# EAGLE design vapeduino_shield_v0001 (EAGLE 8.0.0)

## Sheet 1 of 7
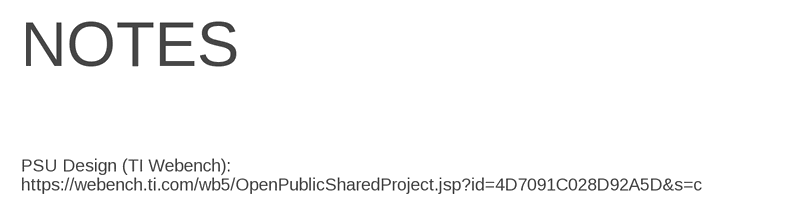
[diagram p0: schematic, sheet 1]

### Notes on the sheet
- NOTES
- PSU Design (TI Webench):
  https://webench.ti.com/wb5/OpenPublicSharedProject.jsp?id=4D7091C028D92A5D&s=c

## Sheet 2 of 7
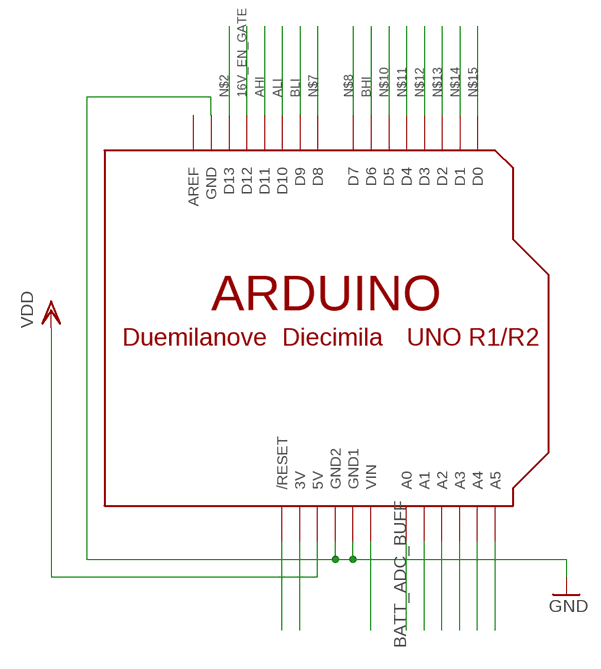
[diagram p1: schematic, sheet 2]

### Parts
U$1  ARDUINOUNO  [ARDUINO]

### Nets
16V_EN_GATE: U$1.D12 ; also sheet 4
AHI: U$1.D11 ; also sheet 5
ALI: U$1.D10 ; also sheet 5
BATT_ADC_BUFF: U$1.A0 ; also sheet 6
BHI: U$1.D6 ; also sheet 5
BLI: U$1.D9 ; also sheet 5
COIL_RES_ADC: U$1.A1 ; also sheet 7
GND: U$1.GND U$1.GND1 U$1.GND2 ; also sheet 3,4,5,6,7
N$2: U$1.D13
N$7: U$1.D8
N$8: U$1.D7
N$10: U$1.D5
N$11: U$1.D4
N$12: U$1.D3
N$13: U$1.D2
N$14: U$1.D1
N$15: U$1.D0
N$16: U$1.RESET(/RESET)
N$17: U$1.3V
N$21: U$1.VIN
N$24: U$1.A2
N$25: U$1.A3
N$26: U$1.A4
N$27: U$1.A5
VDD: U$1.5V ; also sheet 3,4,7
Unconnected: U$1.AREF

## Sheet 3 of 7: 5V
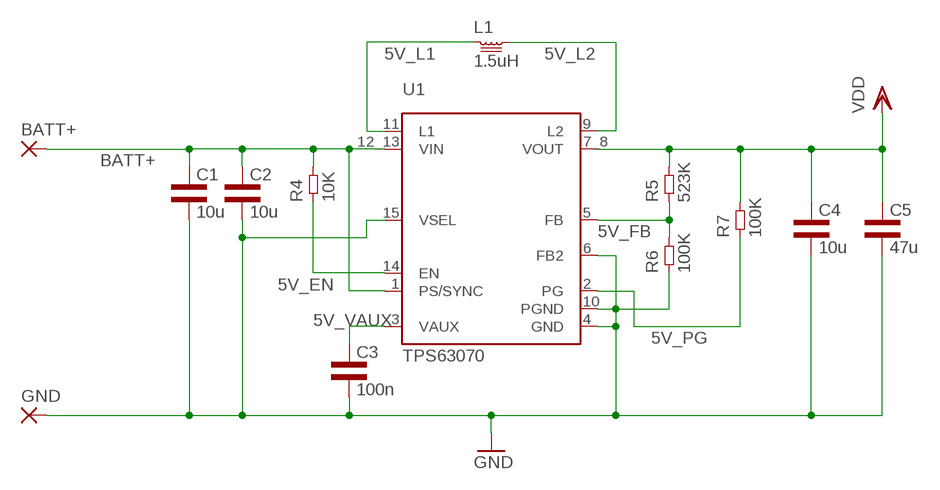
[diagram p2: schematic, sheet 3]

### Parts
BATT+  SMD5  [SMD2,54-5,08]
C1  10u  CAP0603L3  [0603L3]
C2  10u  CAP0603L3  [0603L3]
C3  100n  CAP0603L3  [0603L3]
C4  10u  CAP0603L3  [0603L3]
C5  47u  CAP0805L3  [0805L3]
GND  SMD5  [SMD2,54-5,08]
L1  1.5uH  INDUCTOR4X4  [4X4]
R4  10K  RES0603L3  [0603L3]
R5  523K  RES0603L3  [0603L3]
R6  100K  RES0603L3  [0603L3]
R7  100K  RES0603L3  [0603L3]
U1  TPS63070  [VQFN-HR]

### Nets
5V_EN: R4.P$1 U1.14(EN)
5V_FB: R5.P$1 R6.P$2 U1.5(FB)
5V_L1: L1.1 U1.11(L1)
5V_L2: L1.2 U1.9(L2)
5V_PG: R7.P$1 U1.2(PG)
5V_VAUX: C3.P$1 U1.3(VAUX)
BATT+: BATT+.1(P) C1.P$1 C2.P$1 R4.P$2 U1.1(PS/SYNC) U1.12_13(VIN) ; also sheet 4,6
GND: C1.P$2 C2.P$2 C3.P$2 C4.P$2 C5.2 GND.1(P) R6.P$1 U1.4(GND) U1.6(FB2) U1.10(PGND) U1.15(VSEL) ; also sheet 2,4,5,6,7
VDD: C4.P$1 C5.1 R5.P$2 R7.P$2 U1.7_8(VOUT) ; also sheet 2,4,7

## Sheet 4 of 7: 16V
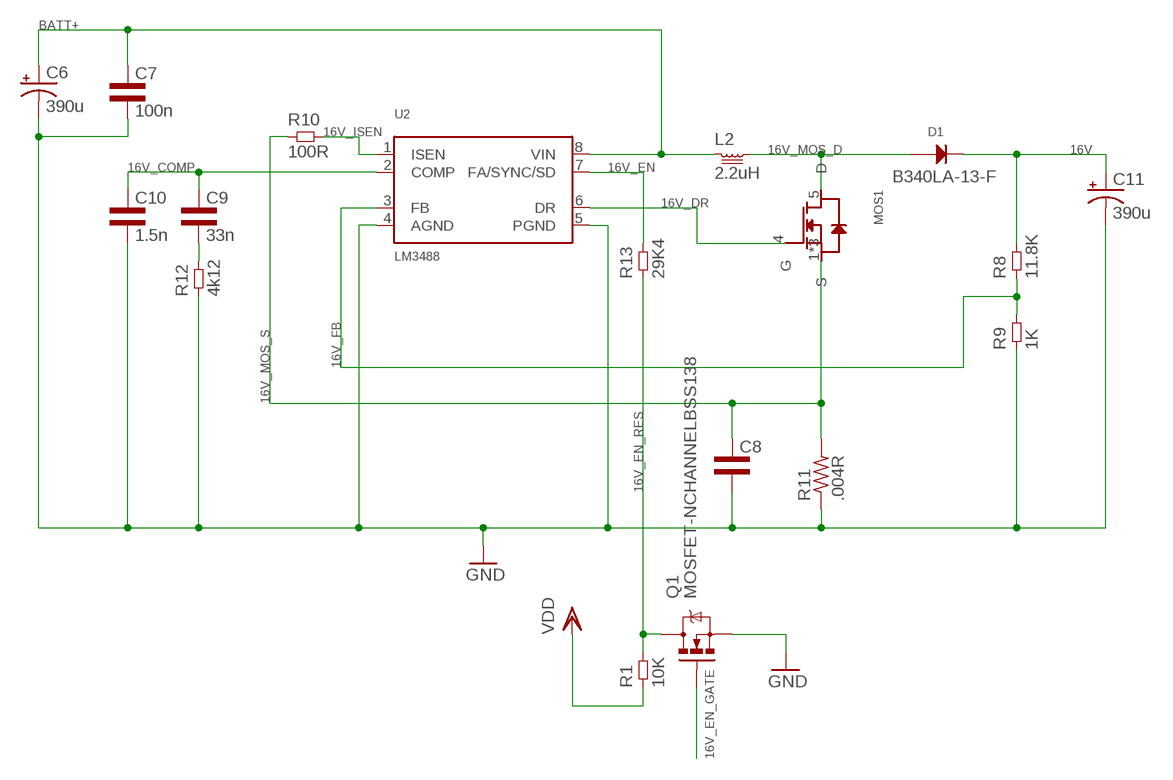
[diagram p3: schematic, sheet 4]

### Parts
C6  390u  CPOL-USG  [PANASONIC_G]
C7  100n  CAP0603L3  [0603L3]
C8  CAP0603L3  [0603L3]
C9  33n  CAP0402L3  [0402L3]
C10  1.5n  CAP0402L3  [0402L3]
C11  390u  CPOL-USG  [PANASONIC_G]
D1  DIODESMA  [SMA]
L2  2.2uH  INDUCTOR7.7X8  [7.7X8]
MOS1  MOSFET-NQ3  [Q3]
Q1  MOSFET-NCHANNELBSS138  [SOT23]
R1  10K  RES0603L3  [0603L3]
R8  11.8K  RES0603L3  [0603L3]
R9  1K  RES0603L3  [0603L3]
R10  100R  RES0603L3  [0603L3]
R11  .004R  R-US_R2512  [R2512]
R12  4k12  RES0402L3  [0402L3]
R13  29K4  RES0603L3  [0603L3]
U2  LM3488  [S-PDSO-G8]

### Nets
16V: C11.+ D1.2(CATHODE) R8.P$2 ; also sheet 5,6
16V_COMP: C9.P$1 C10.P$1 U2.2(COMP)
16V_DR: MOS1.4(G) U2.6(DR)
16V_EN: R13.P$2 U2.7(FA/SYNC/SD)
16V_EN_GATE: Q1.1(G) ; also sheet 2
16V_EN_RES: Q1.3(D) R1.P$2 R13.P$1
16V_FB: R8.P$1 R9.P$2 U2.3(FB)
16V_ISEN: R10.P$2 U2.1(ISEN)
16V_MOS_D: D1.1(ANODE) L2.2 MOS1.5(D)
16V_MOS_S: C8.P$1 MOS1.1(S) MOS1.2(S) MOS1.3(S) R10.P$1 R11.2
BATT+: C6.+ C7.P$1 L2.1 U2.8(VIN) ; also sheet 3,6
GND: C6.- C7.P$2 C8.P$2 C10.P$2 C11.- Q1.2(S) R9.P$1 R11.1 R12.P$1 U2.4(AGND) U2.5(PGND) ; also sheet 2,3,5,6,7
N$33: C9.P$2 R12.P$2
VDD: R1.P$1 ; also sheet 2,3,7

## Sheet 5 of 7
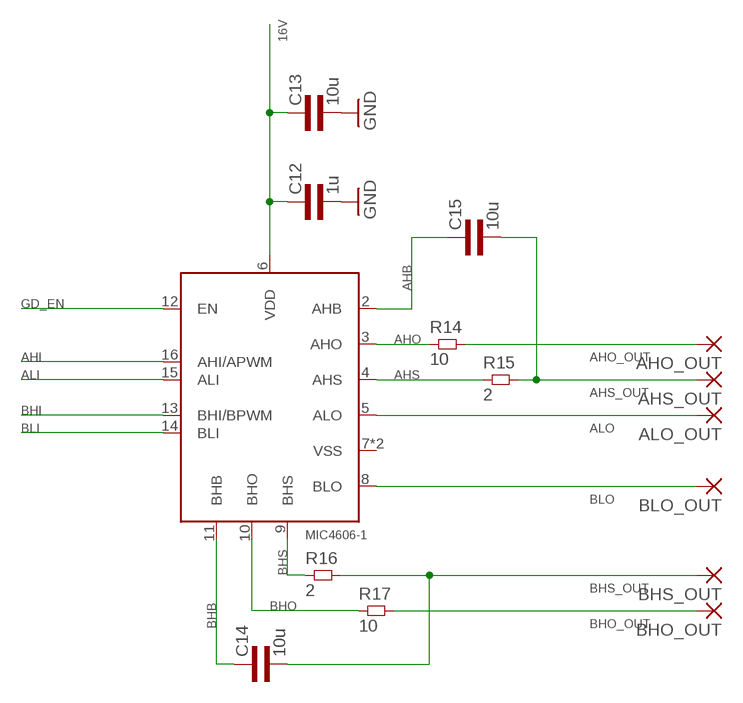
[diagram p4: schematic, sheet 5]

### Parts
AHO_OUT  3,17/1,3  [3,17/1,3]
AHS_OUT  3,17/1,3  [3,17/1,3]
ALO_OUT  3,17/1,3  [3,17/1,3]
BHO_OUT  3,17/1,3  [3,17/1,3]
BHS_OUT  3,17/1,3  [3,17/1,3]
BLO_OUT  3,17/1,3  [3,17/1,3]
C12  1u  CAP0603L3  [0603L3]
C13  10u  CAP0805L3  [0805L3]
C14  10u  CAP1206L3  [1206L3]
C15  10u  CAP1206L3  [1206L3]
MD1  MIC4606-1  [QFN44-16LD-PL-2]
R14  10  RES0805L3  [0805L3]
R15  2  RES0805L3  [0805L3]
R16  2  RES0805L3  [0805L3]
R17  10  RES0805L3  [0805L3]

### Nets
16V: C12.P$1 C13.1 MD1.6(VDD) ; also sheet 4,6
AHB: C15.1 MD1.2(AHB)
AHI: MD1.16(AHI/APWM) ; also sheet 2
AHO: MD1.3(AHO) R14.1
AHO_OUT: AHO_OUT.1(P) R14.2
AHS: MD1.4(AHS) R15.1
AHS_OUT: AHS_OUT.1(P) C15.2 R15.2 ; also sheet 7
ALI: MD1.15(ALI) ; also sheet 2
ALO: ALO_OUT.1(P) MD1.5(ALO)
BHB: C14.1 MD1.11(BHB)
BHI: MD1.13(BHI/BPWM) ; also sheet 2
BHO: MD1.10(BHO) R17.1
BHO_OUT: BHO_OUT.1(P) R17.2
BHS: MD1.9(BHS) R16.1
BHS_OUT: BHS_OUT.1(P) C14.2 R16.2
BLI: MD1.14(BLI) ; also sheet 2
BLO: BLO_OUT.1(P) MD1.8(BLO)
GD_EN: MD1.12(EN)
GND: C12.P$2 C13.2 ; also sheet 2,3,4,6,7
Unconnected: MD1.7(VSS) MD1.TP(VSS)

## Sheet 6 of 7
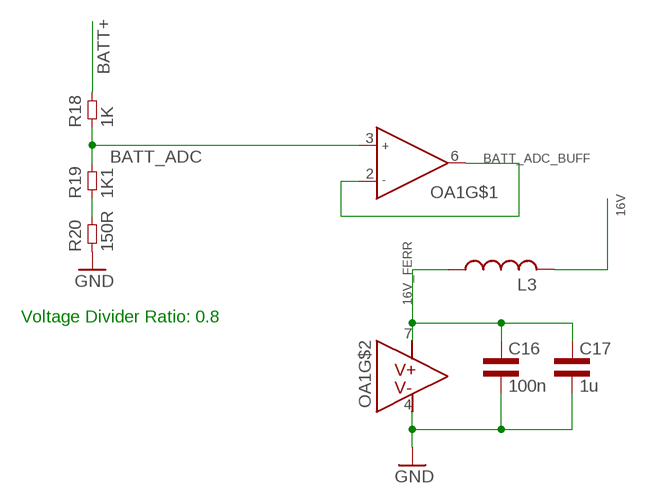
[diagram p5: schematic, sheet 6]

### Parts
C16  100n  CAP0603L3  [0603L3]
C17  1u  CAP0805L3  [0805L3]
L3  L-USL1812  [L1812]
OA1  OPA659DRB  [S-PVSON-N8]
R18  1K  RES0603L3  [0603L3]
R19  1K1  RES0603L3  [0603L3]
R20  150R  RES0603L3  [0603L3]

### Nets
16V: L3.2 ; also sheet 4,5
16V_FERR: C16.P$1 C17.1 L3.1 OA1.7(V+)
BATT+: R18.P$2 ; also sheet 3,4
BATT_ADC: OA1.3(INA+) R18.P$1 R19.P$2
BATT_ADC_BUFF: OA1.2(INA-) OA1.6(OUTA) ; also sheet 2
GND: C16.P$2 C17.2 OA1.4(V-) R20.P$1 ; also sheet 2,3,4,5,7
N$1: R19.P$1 R20.P$2

### Notes on the sheet
- Voltage Divider Ratio: 0.8

## Sheet 7 of 7
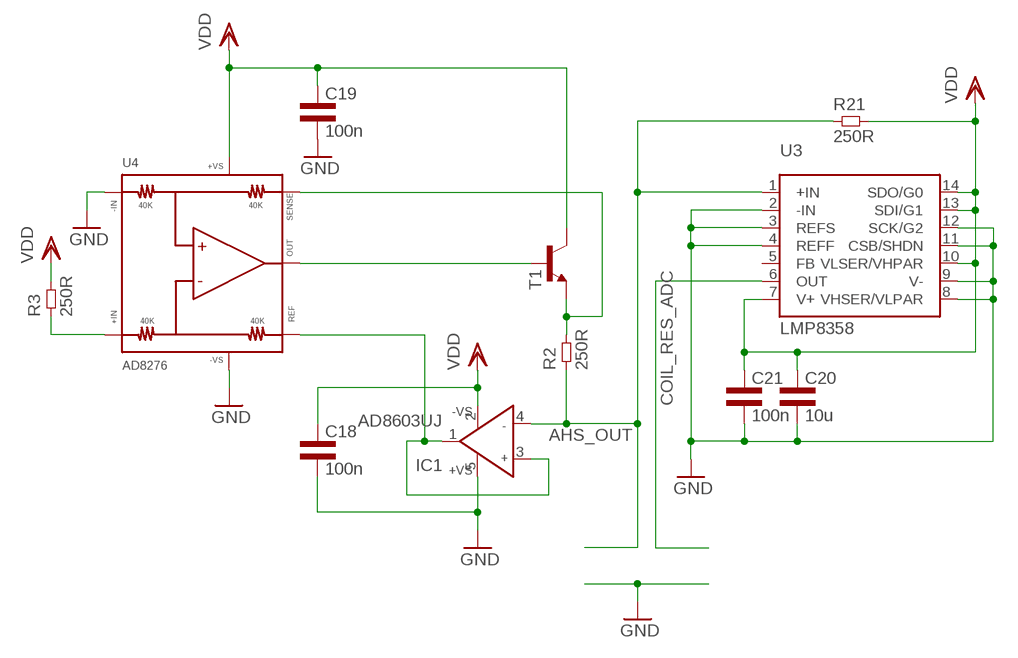
[diagram p6: schematic, sheet 7]

### Parts
C18  100n  CAP0603L3  [0603L3]
C19  100n  CAP0603L3  [0603L3]
C20  10u  CAP0805L3  [0805L3]
C21  100n  CAP0603L3  [0603L3]
IC1  AD8603UJ  [SOT23-5]
R2  250R  RES0603L3  [0603L3]
R3  250R  RES0603L3  [0603L3]
R21  250R  RES0603L3  [0603L3]
T1  TRANSISTOR_MMBT3904LT1-NPN-SOT23-BEC  [TRANSISTOR_SOT23-BEC]
U3  LMP8358  [R-PDSO-G14]
U4  AD8276BRMZ  [S-PDSO-G8]

### Nets
AHS_OUT: IC1.4(IN-) R2.P$1 R21.P$1 U3.1(+IN) ; also sheet 5
COIL_RES_ADC: U3.6(OUT) ; also sheet 2
GND: C18.P$2 C19.P$2 C20.2 C21.P$2 IC1.5(+VS) U3.2(-IN) U3.3(REFS) U3.4(REFF) U3.8(VHSER/VLPAR) U3.9(V-) U3.11(CSB/SHDN) U3.12(SCK/G2) U4.2(-IN) U4.4(-VS) ; also sheet 2,3,4,5,6
N$3: T1.B U4.6(OUT)
N$4: R2.P$2 T1.E U4.5(SENSE)
N$6: IC1.1(OUT) IC1.3(IN+) U4.1(REF)
N$18: R3.P$1 U4.3(+IN)
VDD: C18.P$1 C19.P$1 C20.1 C21.P$1 IC1.2(-VS) R3.P$2 R21.P$2 T1.C U3.7(V+) U3.10(VLSER/VHPAR) U3.13(SDI/G1) U3.14(SDO/G0) U4.7(+VS) ; also sheet 2,3,4
Unconnected: U3.5(FB)

## Library data of the parts
AHO_OUT AHS_OUT ALO_OUT BHO_OUT BHS_OUT BLO_OUT = wirepad:3,17/1,3: THROUGH-HOLE PAD
BATT+ GND = wirepad:SMD5: SMD PAD
C1-C5 C7-C10 C12-C21 = common:CAP
C6 C11 = rcl:CPOL-US: POLARIZED CAPACITOR, American symbol
D1 = common:DIODE; PART#: B340LA-13-F
IC1 = analog-devices:AD8603: Precision Micropower, Low Noise CMOS, Rail-to-Rail Input/Output Operational Amplifiers Source: http://www.analog.com/static/imported-files/data_sheets/AD8603_8607_8609.pdf; MF: ALTERA CORPORATION; MPN: AD8603AUJZ-REEL7; OC_FARNELL: 1651290; OC_NEWARK: 59K6904
L1 L2 = common:INDUCTOR
L3 = rcl:L-US: INDUCTOR, American symbol
MD1 = common:MIC4606: 85V Full-Bridge Mosfet Driver
MOS1 = common:MOSFET-N
OA1 = common:OPA659
Q1 = SparkFun-DiscreteSemi:MOSFET-NCHANNEL: Common NMOSFET Parts MFG P/N Store ID Prod ID FDD8780 TRANS-09984 SI7820DN TRANS-11055 FDS6630A IC-08089 2N7002PW TRANS-11151 FQP30N06L COM-10213 TRANS-10060 BSS123LT1G TRANS-08345 BSS138 TRANS-00830 BS170 2N7000; PROD_ID: TRANS-00830
R1-R10 R12-R21 = common:RES
R11 = rcl:R-US_: RESISTOR, American symbol
T1 = logic:TRANSISTOR_*-NPN-: NPN Transistror BF959 corrected 2008.03.06
U1 = common:TPS63070: TPS63070 High-efficiency, low quiescent current buck-boost converter. Input Range: 2.0V to 16V Output Range: 2.5V to 9V Output Current: 2.0A Buck/Boost
U2 = common:LM3488
U3 = common:LMP8358
U4 = common:AD8276
U$1 = adafruit:ARDUINO: Arduino Diecimila/Duemilanove Make a shield with ease, this package has all the named pins as well as the two mounting drill holes and an outline of the USB and DC power connector. The outline is on the DIMENSION layer, so if your board house uses it they will cut the outline to match. http://www.ladyada.net/library/pcb/eaglelibrary.html

## Board
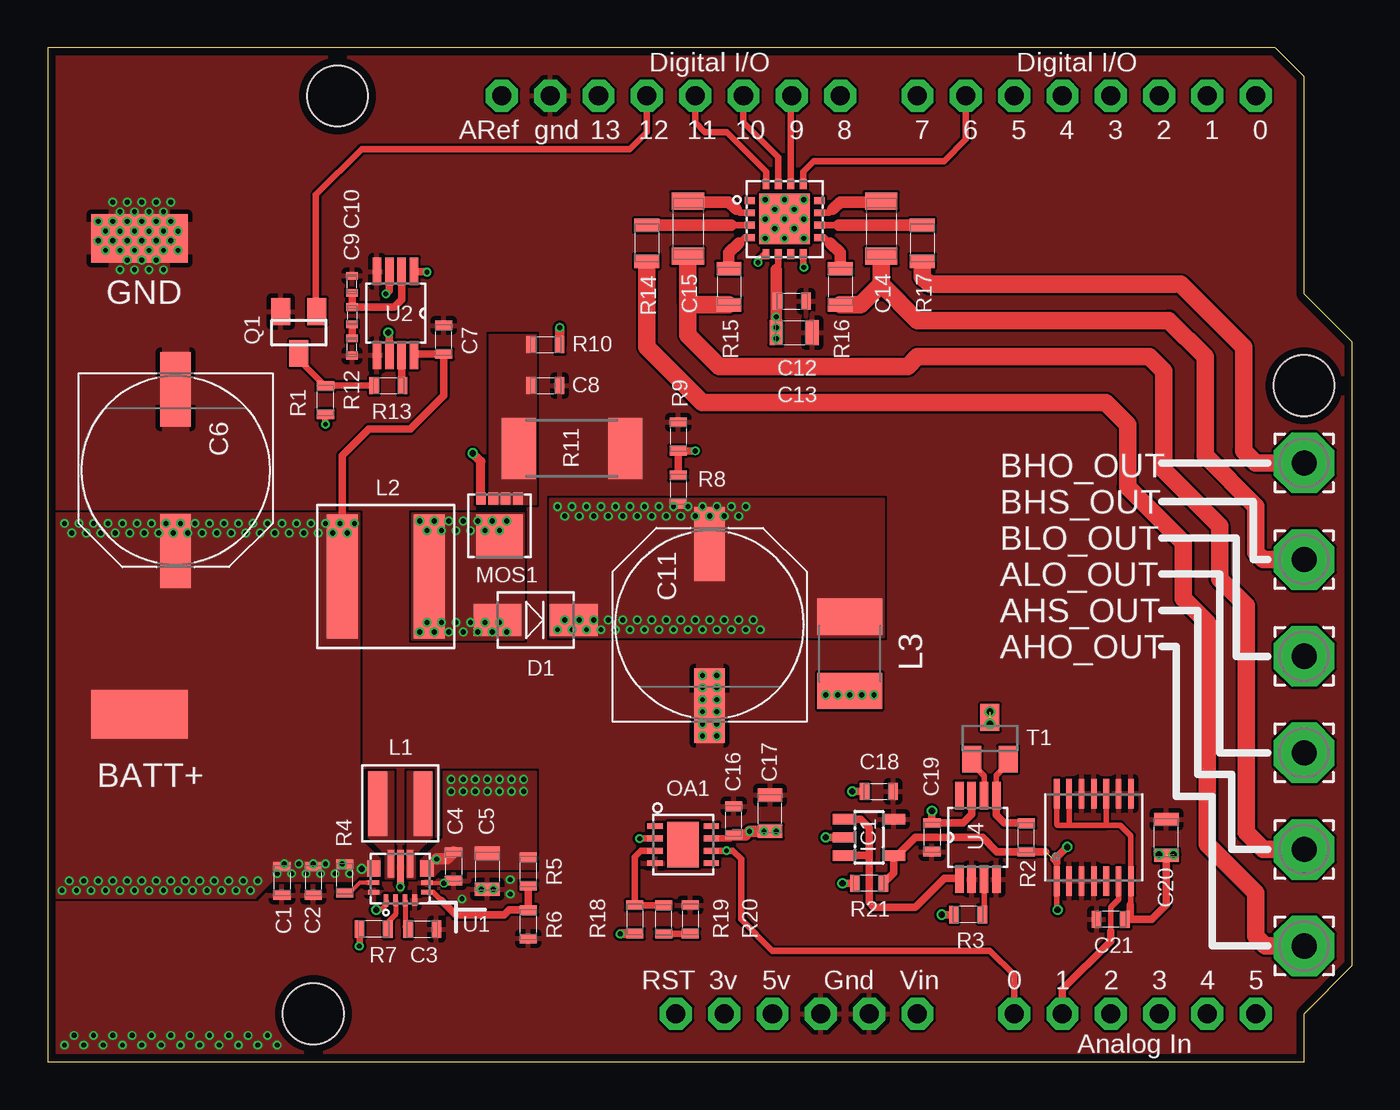
[diagram p7: board, top side]
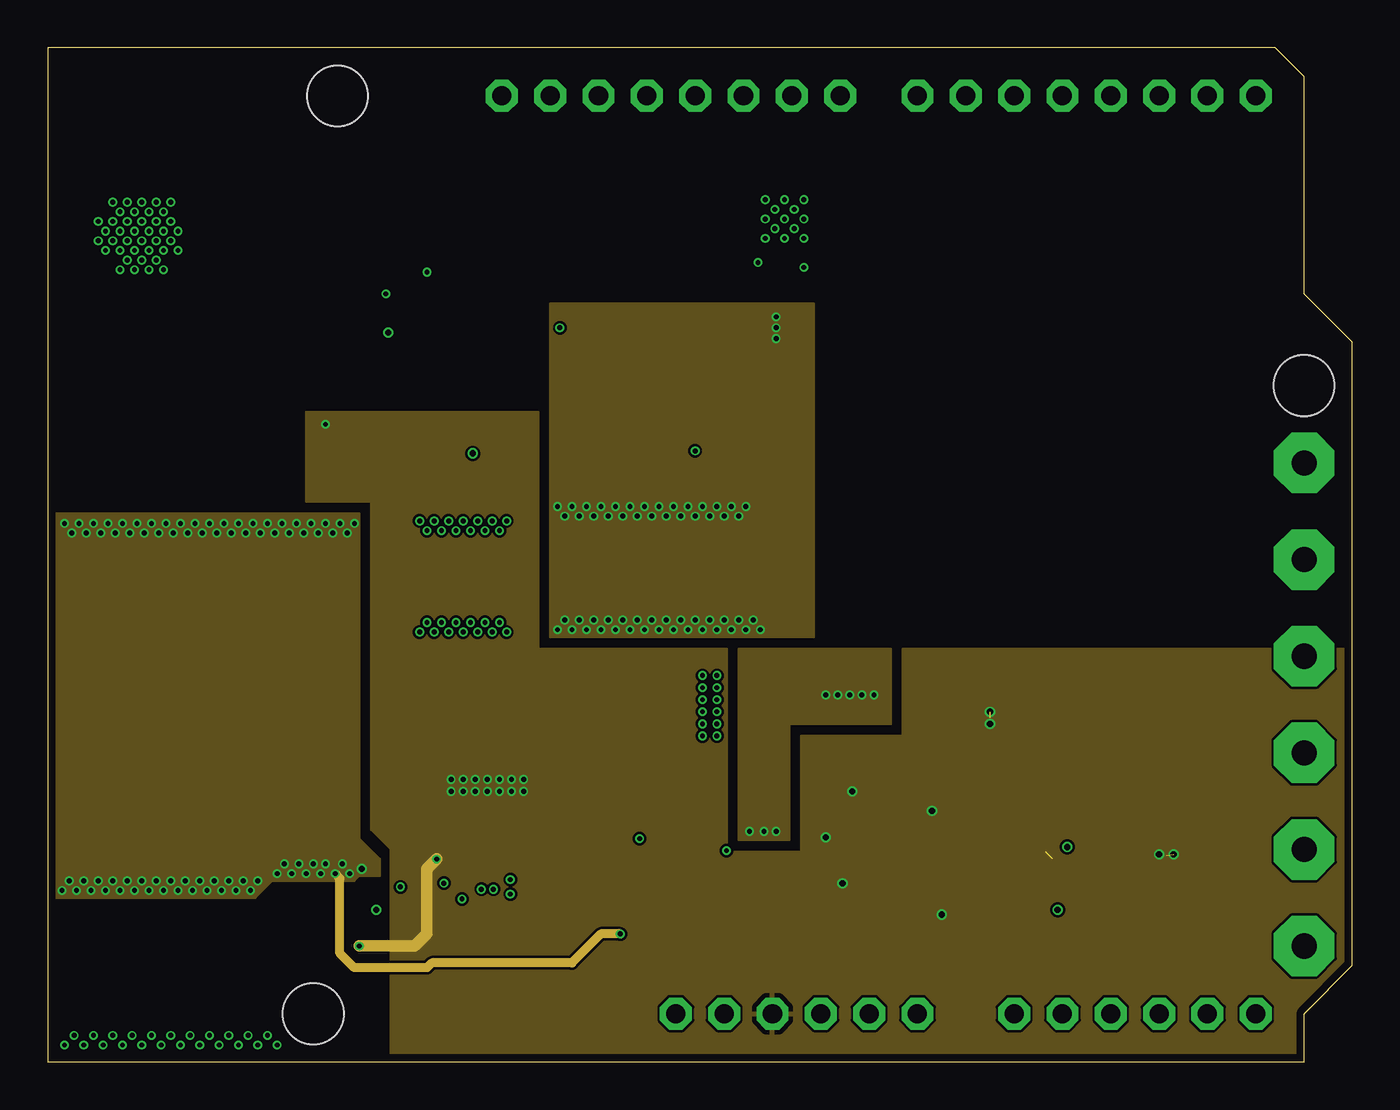
[diagram p8: board, inner layer Route2]
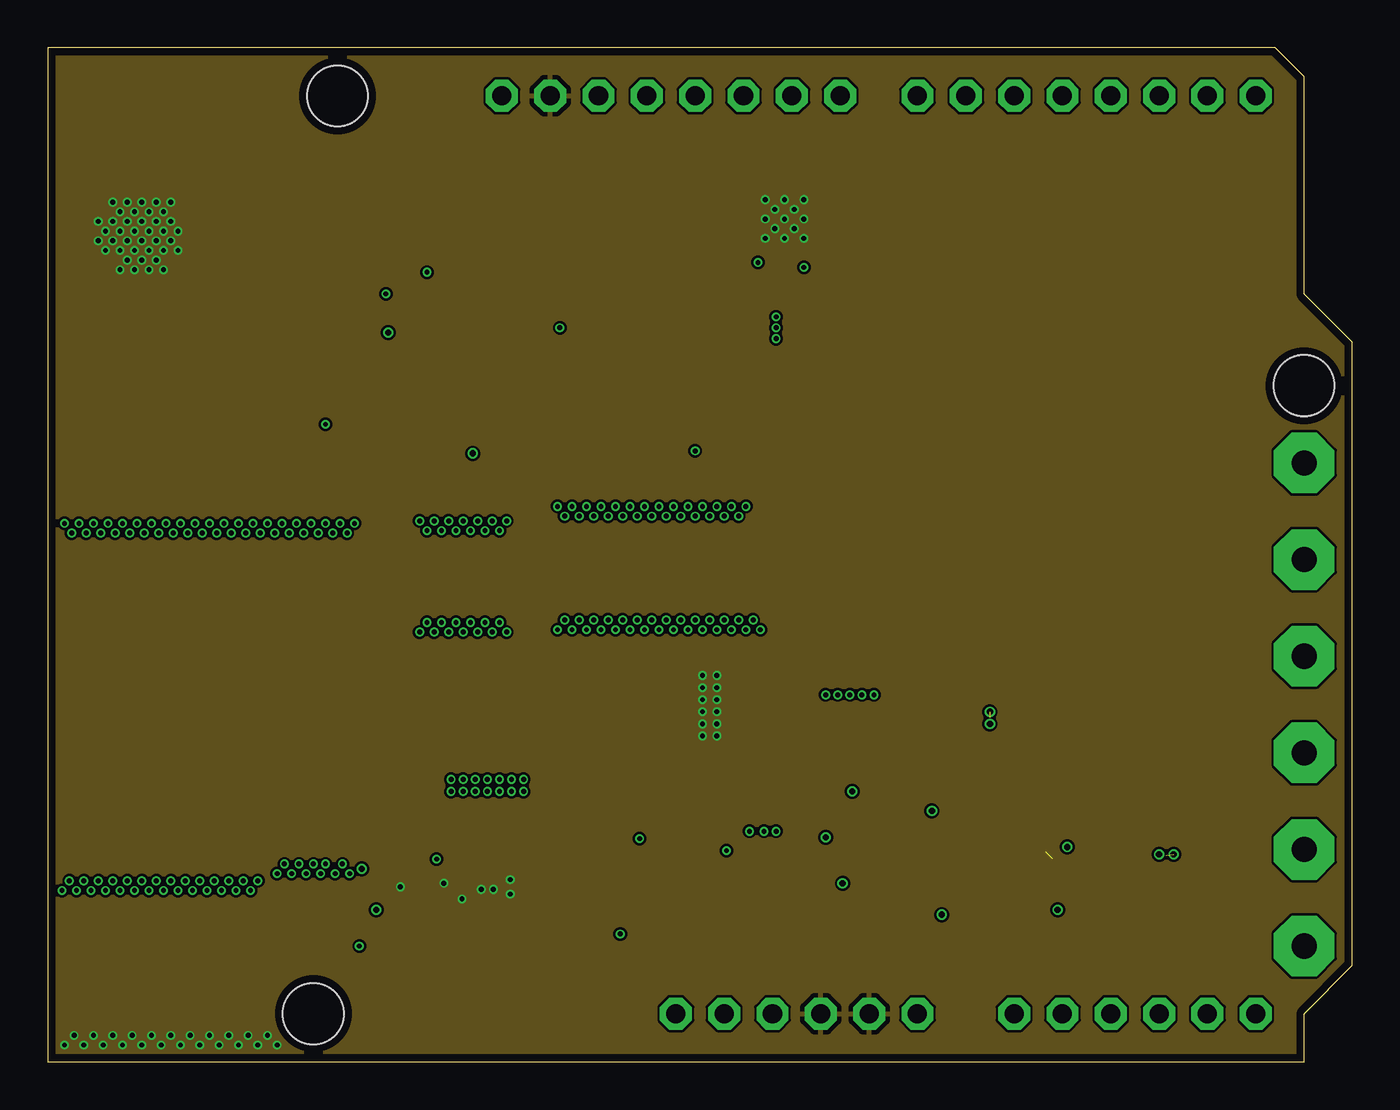
[diagram p9: board, inner layer Route3]
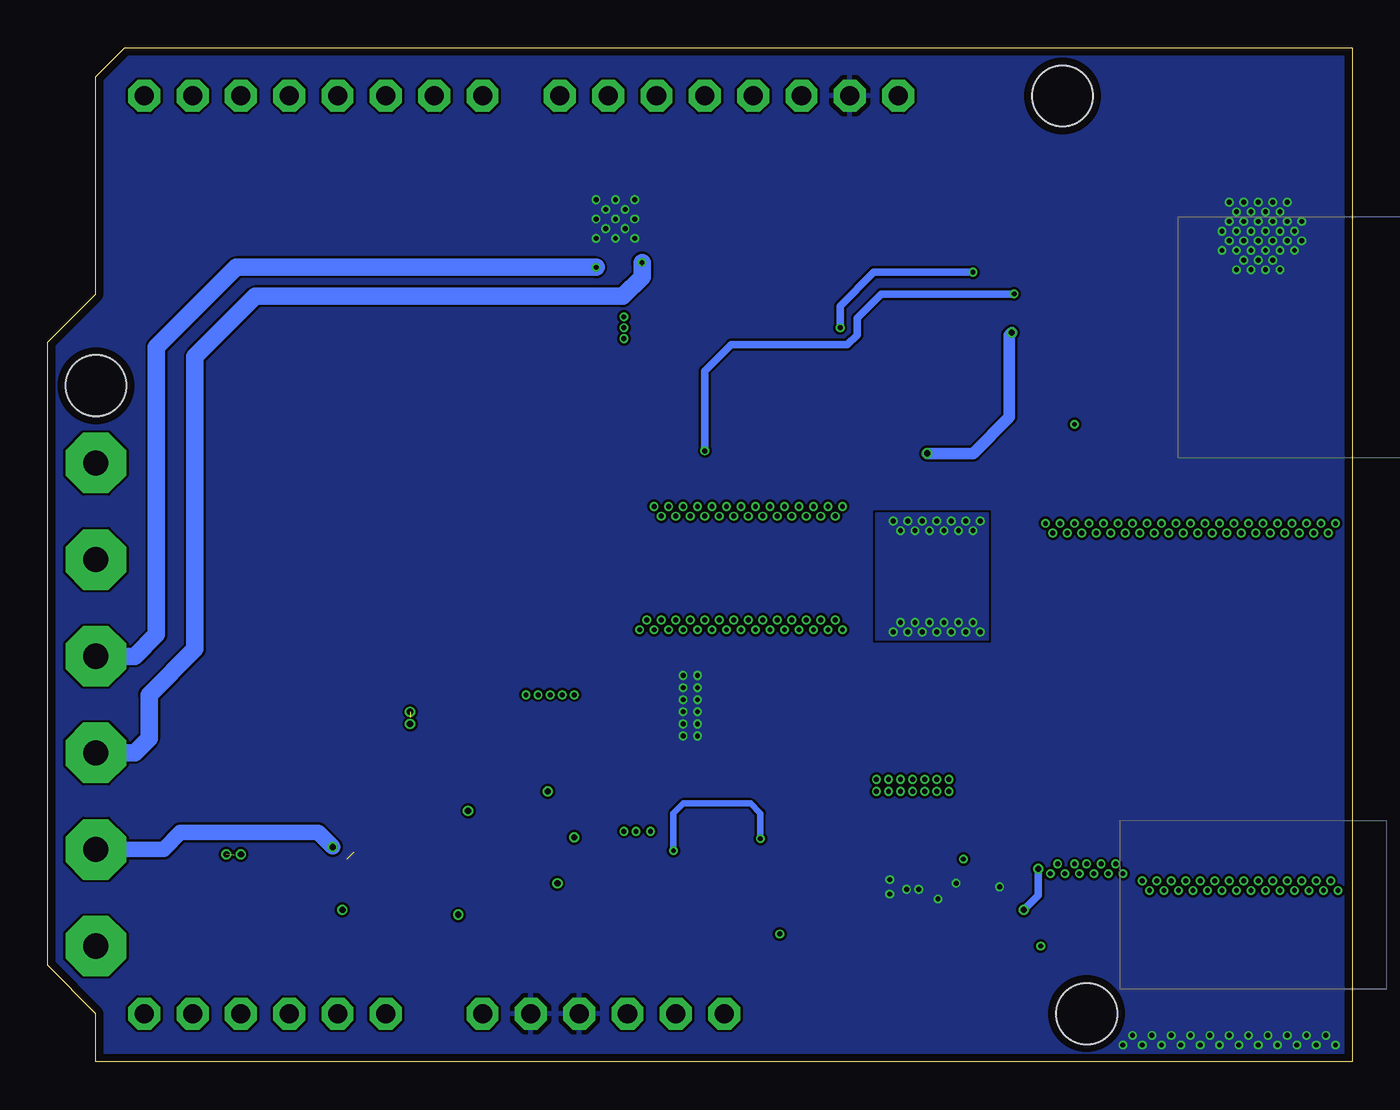
[diagram p10: board, bottom side, seen from below]

Size 68.58 x 53.34 mm. Coordinates in mm from the lower left corner, seen from the top.
Copper layers (1*2*3*16): Top 0.035mm / dielectric 1.5mm / Route2 0.035mm / dielectric 0.15mm / Route3 0.035mm / dielectric 0.2mm / Bottom 0.035mm
Design rules "default *": minimum track width 5mil, minimum drill 10mil, track to track 5mil, track to pad 5mil, pad to pad 5mil, via to via 5mil, smd to smd 0mil, copper to edge 16mil, drill to drill 6mil, minimum pad ring 4mil, minimum via ring 4mil, stop-mask expansion 4mil, vias tented up to drill 20mil, thermal gap 10mil

### Footprints (pad centres in the part's own frame; a part is rotated, then mirrored left to right if it is on the bottom)
3,17/1,3 = drill 1.321 pad 3.175 octagon: 1 0,0
SMD2,54-5,08 = smd 2.54 x 5.08: 1 0,0
0603L3 = smd 0.5 x 0.9: P$1 -0.75,0; P$2 0.75,0
0805L3 = smd 0.7 x 1.3: 1 -0.95,0; 2 0.95,0
PANASONIC_G = smd 3.9 x 1.6: + 4.25,0; - -4.25,0
0402L3 = smd 0.4 x 0.6: P$1 -0.45,0; P$2 0.45,0
1206L3 = smd 0.9 x 1.7: 1 -1.45,0; 2 1.45,0
SMA = smd 2.5 x 1.7: 1 -2,0; 2 2,0
SOT23-5 = smd 0.55 x 1.2: 1 -0.95,-1.3; 2 0,-1.3; 3 0.95,-1.3; 4 0.95,1.3; 5 -0.95,1.3
4X4 = smd 0.98 x 3.4: 1 -1.185,0; 2 1.185,0
7.7X8 = smd 1.63 x 6.5: 1 -2.285,0; 2 2.285,0
L1812 = smd 1.9 x 3.4: 1 -1.95,0; 2 1.95,0
QFN44-16LD-PL-2 = smd 0.53 x 0.36: 1 -1.835,0.975; 2 -1.835,0.325; 3 -1.835,-0.325; 4 -1.835,-0.975; 9 1.835,-0.975; 10 1.835,-0.325; 11 1.835,0.325; 12 1.835,0.975 | smd 0.36 x 0.53: 5 -0.975,-1.835; 6 -0.325,-1.835; 7 0.325,-1.835; 8 0.975,-1.835; 13 0.975,1.835; 14 0.325,1.835; 15 -0.325,1.835; 16 -0.975,1.835 | smd 2.65 x 2.65: TP 0,0
Q3 = smd 0.5 x 0.63: 1 -0.975,-1.435; 2 -0.325,-1.435; 3 0.325,-1.435; 4 0.975,-1.435 | smd 2.45 x 2.31: 5 0,0.56
S-PVSON-N8 = smd 0.3 x 0.8: 1 -0.975,-1.475; 2 -0.325,-1.475; 3 0.325,-1.475; 4 0.975,-1.475; 5 0.975,1.475; 6 0.325,1.475; 7 -0.325,1.475; 8 -0.975,1.475 | smd 2.4 x 1.65: P$1 0,0
SOT23 = smd 1 x 1.4: 1 -0.95,-1.1; 2 0.95,-1.1; 3 0,1.1
R2512 = smd 1.8 x 3.2: 1 -2.8,0; 2 2.8,0
TRANSISTOR_SOT23-BEC = smd 1 x 1.4: B -0.95,-1.1; C 0,1.1; E 0.95,-1.1
VQFN-HR = smd 0.6 x 0.25: 1 -1.15,0.75; 2 -1.15,0.25; 3 -1.15,-0.25; 4 -1.15,-0.75 | smd 0.25 x 0.6: 5 -0.725,-1.4; 6 -0.225,-1.4; 14 -0.225,1.4; 15 -0.725,1.4 | smd 0.85 x 0.7: 7_8 0.525,-1.4; 12_13 0.525,1.4 | smd 1.45 x 0.35: 9 0.775,-0.5; 11 0.775,0.5 | smd 1.8 x 0.35: 10 0.6,0
S-PDSO-G8 = smd 0.45 x 1.45: 1 -0.975,-2.2; 2 -0.325,-2.2; 3 0.325,-2.2; 4 0.975,-2.2; 5 0.975,2.2; 6 0.325,2.2; 7 -0.325,2.2; 8 -0.975,2.2
R-PDSO-G14 = smd 0.3 x 1.55: 1 -1.95,-2.3; 2 -1.3,-2.3; 3 -0.65,-2.3; 4 0,-2.3; 5 0.65,-2.3; 6 1.3,-2.3; 7 1.95,-2.3; 8 1.95,2.3; 9 1.3,2.3; 10 0.65,2.3; 11 0,2.3; 12 -0.65,2.3; 13 -1.3,2.3; 14 -1.95,2.3
ARDUINO = drill 1 pad 1.676 octagon: 3V 35.56,2.54; 5V 38.1,2.54; A0 50.8,2.54; A1 53.34,2.54; A2 55.88,2.54; A3 58.42,2.54; A4 60.96,2.54; A5 63.5,2.54; AREF 23.876,50.8; D0 63.5,50.8; D1 60.96,50.8; D2 58.42,50.8; D3 55.88,50.8; D4 53.34,50.8; D5 50.8,50.8; D6 48.26,50.8; D7 45.72,50.8; D8 41.656,50.8; D9 39.116,50.8; D10 36.576,50.8; D11 34.036,50.8; D12 31.496,50.8; D13 28.956,50.8; GND 26.416,50.8; GND1 43.18,2.54; GND2 40.64,2.54; RESET 33.02,2.54; VIN 45.72,2.54 | hole 3.2: 15.24,50.8; 66.04,35.56; 13.97,2.54

### Placement (x,y rotation side)
AHO_OUT  66.04,6.1 180 top
AHS_OUT  66.04,11.18 180 top
ALO_OUT  66.04,16.26 180 top
BATT+  4.83,18.29 90 top
BHO_OUT  66.04,31.5 180 top
BHS_OUT  66.04,26.42 180 top
BLO_OUT  66.04,21.34 180 top
C1  12.32,9.53 270 top
C2  13.97,9.53 270 top
C3  19.68,6.99 0 top
C4  21.34,10.29 270 top
C5  23.11,10.03 270 top
C6  6.73,31.11 270 top
C7  20.83,37.97 90 top
C8  26.16,35.56 0 top
C9  16,39.24 270 top
C10  16,40.89 90 top
C11  34.8,22.99 90 top
C12  39.12,40.01 0 top
C13  39.24,38.35 0 top
C14  43.81,43.81 270 top
C15  33.66,43.81 270 top
C16  36.07,12.7 90 top
C17  37.97,13.08 90 top
C18  43.69,14.22 0 top
C19  46.48,11.81 270 top
C20  58.8,11.81 90 top
C21  55.88,7.49 180 top
D1  25.65,23.24 0 top
GND  4.83,43.31 90 top
IC1  43.18,11.81 270 top
L1  18.54,13.59 0 top
L2  17.78,25.53 0 top
L3  42.16,21.46 90 top
MD1  38.73,44.32 0 top
MOS1  23.75,28.19 180 top
OA1  33.4,11.43 270 top
Q1  13.21,38.35 180 top
R1  14.61,34.8 90 top
R2  51.44,11.81 90 top
R3  48.39,7.75 180 top
R4  15.62,9.65 90 top
R5  25.27,10.03 90 top
R6  25.27,7.24 90 top
R7  17.14,6.99 180 top
R8  33.15,30.1 270 top
R9  33.15,32.89 270 top
R10  26.16,37.72 0 top
R11  27.56,32.26 180 top
R12  16,37.59 90 top
R13  17.91,35.56 0 top
R14  31.5,43.05 270 top
R15  35.81,40.77 270 top
R16  41.66,40.77 270 top
R17  45.97,43.05 270 top
R18  30.86,7.49 270 top
R19  32.38,7.49 90 top
R20  33.78,7.49 270 top
R21  43.18,9.4 180 top
T1  49.53,17.02 0 top
U1  18.54,9.65 90 top
U2  18.29,39.37 180 top
U3  54.99,11.81 0 top
U4  48.9,11.81 0 top
U$1  0,0 0 top

### Tracks (layer width: path | path; a pad name or v marks a point on that pad's centre or on a via)
5V_EN
  Top 0.203: 16.79,9.43 16.41,9.43 15.88,8.89 15.63,8.89 R4.P$1
  Top 0.254: U1.14 16.79,9.43 | R4.P$1 15.63,8.76
5V_FB
  Top 0.254: U1.5 20.28,8.93 20.7,8.51
  Top 0.406: 20.7,8.51 21.46,7.75 24,7.75 24.26,8 R6.P$2 R5.P$1
5V_L1
  pour Top (no thermals): 17.78,9.65 17.78,10.92 16.89,11.81 16.89,15.24 18.16,15.24 18.16,9.65
5V_L2
  pour Top (no thermals): 18.92,9.65 18.92,15.24 20.19,15.24 20.19,11.81 19.3,10.92 19.3,9.65
5V_PG
  Top 0.254: U1.2 18.29,7.75 17.91,7.37 17.91,7 R7.P$1
5V_VAUX
  Top 0.254: U1.3 18.79,7.13 C3.P$1
16V  (via drill 0.25)
  Top 0.203: C12.P$1 38.37,39.26 v38.29,39.18
  Top 0.33: MD1.6 38.41,41.92 38.29,41.66
  Top 0.61: v38.29,39.18 v38.29,38.61 38.29,38.48 | v38.29,39.18 v38.29,38.04 38.29,38.48 | 38.29,38.48 C13.1 | 38.29,41.66 v38.29,39.18
  other vias: 26.8,29.21 27.56,29.21 28.32,29.21 29.08,29.21 29.84,29.21 30.61,29.21 31.37,29.21 32.13,29.21 32.89,29.21 33.66,29.21 34.42,29.21 35.18,29.21 35.94,29.21 36.7,29.21 27.18,28.7 27.94,28.7 28.7,28.7 29.46,28.7 30.23,28.7 30.99,28.7 31.75,28.7 32.51,28.7 33.27,28.7 34.04,28.7 34.8,28.7 35.56,28.7 36.32,28.7 26.8,22.73 27.56,22.73 28.32,22.73 29.08,22.73 29.84,22.73 30.61,22.73 31.37,22.73 32.13,22.73 32.89,22.73 33.66,22.73 34.42,22.73 35.18,22.73 35.94,22.73 36.7,22.73 37.47,22.73 27.18,23.24 27.94,23.24 28.7,23.24 29.46,23.24 30.23,23.24 30.99,23.24 31.75,23.24 32.51,23.24 33.27,23.24 34.04,23.24 34.8,23.24 35.56,23.24 36.32,23.24 37.08,23.24
  pour Top (no thermals): 43.94,29.59 26.42,29.59 26.42,22.35 43.94,22.35
  pour Route2 (no thermals): 40.26,39.88 26.42,39.88 26.42,22.35 40.26,22.35
16V_COMP
  Top 0.406: C10.P$1 C9.P$1 18.23,39.69 18.61,40.08 U2.2
16V_DR  (via drill 0.33)
  Top 0.406: U2.6 17.96,38.3 v17.91,38.35
  Top 0.483: MOS1.4 22.77,31.58 v22.35,32
  Bottom 0.61: 17.96,38.3 v17.91,38.35 18.03,38.23 18.03,33.91 19.94,32 v22.35,32
16V_EN
  Top 0.406: U2.7 18.61,35.6 R13.P$2
16V_EN_GATE
  Top 0.33: 14.1,39.52 Q1.1 14.1,39.52 | 14.1,39.52 14.1,45.59 16.51,48.01 30.61,48.01 31.5,48.9 U$1.D12
16V_EN_RES
  Top 0.33: R13.P$1 R1.P$2 13.21,36.95 Q1.3
16V_FB  (via drill 0.25)
  Top 0.406: U2.3 17.96,40.57 v17.78,40.39 | R8.P$1 R9.P$2 33.13,32.13 v34.04,32.13
  Bottom 0.406: v17.78,40.39 24.77,40.39 26.04,39.12 26.04,38.23 26.54,37.72 32.64,37.72 34.04,36.32 v34.04,32.13
16V_FERR  (via drill 0.25)
  Top 0.203: L3.1 v42.16,19.3
  Top 0.33: OA1.7 35.87,11.76 C16.P$1
  Top 0.61: C16.P$1 36.08,11.94 36.7,11.94 v36.89,12.13 v36.9,12.13 C17.1
  other vias: 37.66,12.13 38.29,12.13 41.53,19.3 40.89,19.3 42.8,19.3 43.43,19.3
  pour Route2: 36.32,11.68 36.32,21.72 44.32,21.72 44.32,17.78 38.99,17.78 38.99,11.68
16V_ISEN  (via drill 0.25)
  Top 0.406: U2.1 19.9,41.57 v19.94,41.53
  Top 0.508: R10.P$2 26.91,38.6 v26.92,38.61
  Bottom 0.406: v19.94,41.53 25.15,41.53 26.92,39.75 v26.92,38.61
16V_MOS_D  (via drill 0.25)
  other vias: 19.56,28.45 20.32,28.45 21.08,28.45 21.84,28.45 22.61,28.45 23.37,28.45 24.13,28.45 23.75,27.94 22.99,27.94 22.23,27.94 21.46,27.94 20.7,27.94 19.94,27.94 19.56,22.61 20.32,22.61 21.08,22.61 21.84,22.61 22.61,22.61 23.37,22.61 24.13,22.61 19.94,23.11 20.7,23.11 21.46,23.11 22.23,23.11 22.99,23.11 23.75,23.11
  pour Top (no thermals): 19.18,28.83 25.02,28.83 25.02,22.23 19.18,22.23
  pour Bottom (no thermals): 19.18,28.83 25.02,28.83 25.02,22.23 19.18,22.23
16V_MOS_S
  pour Top (no thermals): 23.24,29.34 23.24,38.23 25.65,38.23 25.65,29.34
AHB
  Top 0.33: MD1.2 36.38,44.65 36.2,44.83
  Top 0.61: 36.2,44.83 35.81,45.21 33.71,45.21 C15.1
AHI
  Top 0.33: U$1.D11 34.04,49.4 34.54,48.9 35.69,48.9 37.76,46.82 MD1.16
AHO
  Top 0.33: MD1.3 36.33,44 35.94,44.01
  Top 0.61: R14.1 35.94,44.01
AHO_OUT
  Top 0.61: R14.2 31.5,41.78
  Top 0.914: 31.5,41.78 31.5,37.59 34.42,34.67 55.63,34.67 56.77,33.53 56.77,30.23 59.69,27.3 59.69,24.38 60.96,23.11 60.96,11.43 63.5,8.89 63.5,6.6 64.01,6.1 AHO_OUT.1
AHS
  Top 0.33: MD1.4 36.62,43.35 36.32,43.05
  Top 0.61: 36.32,43.05 35.81,42.55 R15.1
AHS_OUT  (via drill 0.33)  (1 unrouted)
  Top 0.279: v53.09,8 53.04,8.05 U3.1 53.04,10.46 52.83,10.67
  Top 0.406: 52.45,11.05 51.45,11.05 R2.P$1 49.9,11.06 49.15,11.81 45.59,11.81 44.7,10.92 44.54,10.92 IC1.4 44.48,9.95 R21.P$1 | 53.04,10.46 53.04,10.75 v53.59,11.3
  Top 0.914: 33.66,39.88 C15.2 | 33.66,39.88 33.66,38.23 35.31,36.58 45.21,36.58 45.72,37.08 57.91,37.08 58.67,36.32 58.67,31.11 61.59,28.19 61.59,25.4 62.99,24 62.99,12.06 63.88,11.18 AHS_OUT.1 | R15.2 33.72,39.82 33.66,39.88
  Bottom 0.813: v53.59,11.3 54.36,12.06 61.59,12.06 62.48,11.18 AHS_OUT.1
ALI
  Top 0.33: U$1.D10 36.58,49.4 38.41,47.57 MD1.15
ALO  (via drill 0.25)
  Top 0.33: MD1.5 37.66,42.49 37.34,42.16 v37.34,42.04
  Bottom 0.914: v37.34,42.04 37.34,41.27 38.35,40.26 57.66,40.26 60.83,37.08 60.83,21.72 63.25,19.3 63.25,17.02 64.01,16.26 ALO_OUT.1
BATT+  (via drill 0.25, 0.33)
  Top 0.254: U1.1 17.79,8.27 17.53,8 v17.27,8
  Top 0.406: 20.77,37.17 C7.P$1 | 19.26,36.74 U2.8 19.32,37.22 C7.P$1 | L2.1 15.49,31.88 16.89,33.27 19.05,33.27 20.83,35.05 C7.P$1
  Top 0.483: R18.P$2 30.11,6.74 v30.1,6.73
  Route2 0.483: v30.1,6.73 29.08,6.73 27.56,5.21 20.19,5.21 19.94,4.95 16.13,4.95 15.37,5.71 15.37,9.65 v15.11,9.91
  Bottom 0.406: v17.27,8 16.51,8.76 v16.51,10.16
  other vias: 0.89,28.32 1.65,28.32 2.41,28.32 3.17,28.32 3.94,28.32 4.7,28.32 5.46,28.32 6.22,28.32 6.99,28.32 7.75,28.32 8.51,28.32 9.27,28.32 10.03,28.32 10.79,28.32 11.56,28.32 12.32,28.32 13.08,28.32 13.84,28.32 14.61,28.32 15.37,28.32 16.13,28.32 15.75,27.81 14.99,27.81 14.22,27.81 13.46,27.81 12.7,27.81 11.94,27.81 11.18,27.81 10.41,27.81 9.65,27.81 8.89,27.81 8.13,27.81 7.37,27.81 6.6,27.81 5.84,27.81 5.08,27.81 4.32,27.81 3.56,27.81 2.79,27.81 2.03,27.81 1.27,27.81 0.76,9.02 1.52,9.02 2.29,9.02 3.05,9.02 3.81,9.02 4.57,9.02 5.33,9.02 6.1,9.02 6.86,9.02 7.62,9.02 8.38,9.02 9.14,9.02 9.91,9.02 10.67,9.02 11.05,9.53 12.06,9.91 12.83,9.91 13.59,9.91 14.35,9.91 15.88,9.91 15.49,10.41 14.61,10.41 13.97,10.41 13.21,10.41 12.45,10.41 10.29,9.53 9.53,9.53 8.76,9.53 8,9.53 7.24,9.53 6.48,9.53 5.71,9.53 4.95,9.53 4.19,9.53 3.43,9.53 2.67,9.53 1.91,9.53 1.14,9.53
  pour Top (no thermals): 17.46,9.78 16.38,9.78 16.13,9.53 11.81,9.53 10.92,8.64 0.25,8.64 0.25,28.83 16.38,28.83 16.38,11.75 17.46,10.67
  pour Route2 (no thermals): 17.46,9.78 16.38,9.78 16.13,9.53 11.81,9.53 10.92,8.64 0.25,8.64 0.25,28.83 16.38,28.83 16.38,11.75 17.46,10.67
BATT_ADC
  Top 0.33: OA1.3 31.17,11.11 30.86,10.79 R18.P$1 R19.P$2
BATT_ADC_BUFF  (via drill 0.25)
  Top 0.33: OA1.6 v35.68,11.11 v35.69,11.11 36.01,11.11 36.45,10.67 36.45,7.49 38.1,5.84 49.53,5.84 50.8,4.57 U$1.A0 | OA1.2 31.12,11.76 v31.11,11.75
  Bottom 0.33: v31.11,11.75 31.11,13.08 31.62,13.59 35.18,13.59 35.69,13.08 v35.69,11.11
BHB
  Top 0.33: MD1.11 41.09,44.65 41.27,44.83
  Top 0.61: 41.27,44.83 41.66,45.21 43.76,45.21 C14.1
BHI
  Top 0.33: MD1.13 39.71,46.82 40.26,47.37 47.12,47.37 48.26,48.51 U$1.D6
BHO
  Top 0.33: MD1.10 41.33,44 41.59,44.01
  Top 0.61: 41.59,44.01 R17.1
BHO_OUT
  Top 0.711: R17.2 45.97,41.91
  Top 0.914: 45.97,41.91 45.97,41.27 46.35,40.89 59.56,40.89 62.87,37.59 62.87,32.13 63.5,31.5 BHO_OUT.1
BHS
  Top 0.33: MD1.9 40.85,43.35 41.15,43.05
  Top 0.61: 41.15,43.05 41.66,42.55 R16.1
BHS_OUT
  Top 0.914: 43.81,40.89 C14.2 | 43.81,40.89 45.72,38.99 58.93,38.99 60.83,37.08 60.83,31.88 63.5,29.21 63.5,26.8 63.88,26.42 BHS_OUT.1 | R16.2 42.74,39.82 43.81,40.89
BLI
  Top 0.33: MD1.14 39.06,50.74 U$1.D9
BLO  (via drill 0.25)
  Top 0.33: MD1.8 39.71,41.82 v39.75,41.78
  Bottom 0.914: v39.75,41.78 58.67,41.78 62.87,37.59 62.87,22.48 64.01,21.34 BLO_OUT.1
COIL_RES_ADC
  Top 0.279: U3.6 56.29,8.54 55.88,8.13 55.88,6.86
  Top 0.406: 55.88,6.86 55.88,6.35 53.34,3.81 U$1.A1
GND  (via drill 0.25)
  Top 0.203: U1.6 20.8,9.43 v20.83,9.4
  other vias: 0.89,0.89 1.91,0.89 2.92,0.89 3.94,0.89 4.95,0.89 5.97,0.89 6.99,0.89 8,0.89 9.02,0.89 10.03,0.89 11.05,0.89 12.06,0.89 1.4,1.4 2.41,1.4 3.43,1.4 4.45,1.4 5.46,1.4 6.48,1.4 7.49,1.4 8.51,1.4 9.53,1.4 10.54,1.4 11.56,1.4 34.42,20.32 35.18,20.32 34.42,19.68 35.18,19.68 34.42,19.05 35.18,19.05 34.42,18.41 35.18,18.41 34.42,17.78 35.18,17.78 34.42,17.14 35.18,17.14 22.8,9.08 23.43,9.08 21.78,8.57 24.32,8.83 24.32,9.59 18.54,9.21 37.72,45.34 38.73,45.34 39.75,45.34 37.72,44.32 37.72,43.31 38.73,44.32 38.73,43.31 39.75,43.31 39.75,44.32 39.24,44.83 38.23,44.83 38.23,43.81 39.24,43.81 2.67,44.2 3.43,44.2 4.19,44.2 4.95,44.2 5.71,44.2 6.48,44.2 3.05,43.69 3.81,43.69 4.57,43.69 5.33,43.69 6.1,43.69 6.86,43.69 2.67,43.18 3.43,43.18 4.19,43.18 4.95,43.18 5.71,43.18 6.48,43.18 3.05,42.67 3.81,42.67 4.57,42.67 5.33,42.67 6.1,42.67 6.86,42.67 3.81,44.7 4.57,44.7 5.33,44.7 6.1,44.7 4.19,42.16 4.95,42.16 5.71,42.16 3.81,41.66 4.57,41.66 5.33,41.66 6.1,41.66 3.43,45.21 4.19,45.21 4.95,45.21 5.71,45.21 6.48,45.21
  pour Top (rank 6): 0,53.21 68.58,53.21 68.58,0 0.13,0 0,0
  pour Bottom (rank 6): 0,53.21 73.15,53.21 73.15,0 0,0
  pour Route3 (rank 6): 0,53.21 71.63,53.21 71.63,0 0,0
  pour Top (no thermals): 3.3,45.21 3.3,44.2 6.35,44.2 6.35,45.21
  pour Top (no thermals): 3.3,42.42 3.3,41.4 6.35,41.4 6.35,42.42
  pour Top (no thermals): 7.24,44.07 7.75,44.07 7.75,42.55 7.24,42.55
  pour Top (no thermals): 1.91,44.07 2.41,44.07 2.41,42.55 1.91,42.55
  pour Top (no thermals): 34.04,19.3 33.66,19.3 33.66,18.16 34.16,18.16 34.16,19.3
  pour Top (no thermals): 35.81,19.3 35.43,19.3 35.43,18.16 35.94,18.16 35.94,19.3
  pour Top (no thermals): 34.16,20.95 34.16,20.45 35.43,20.45 35.43,20.95
  pour Top (no thermals): 28.96,34.42 31.75,34.42 31.75,30.23 28.96,30.23
  pour Top (no thermals): 34.16,16.89 34.16,16.38 35.43,16.38 35.43,16.89
  pour Top (no thermals): 6.1,37.72 6.1,37.21 7.37,37.21 7.37,37.72
  pour Top (no thermals): 6.1,33.53 6.1,33.02 7.37,33.02 7.37,33.53
  pour Top (no thermals): 7.37,34.67 7.87,34.67 7.87,35.94 7.37,35.94
  pour Top (no thermals): 5.59,34.67 6.1,34.67 6.1,35.94 5.59,35.94
N$1
  Top 0.33: R19.P$1 R20.P$2
N$3
  Top 0.279: U4.6 49.22,15.04 48.64,15.62 48.64,15.86 T1.B
N$4
  Top 0.279: U4.5 49.87,15.07 50.55,15.75 50.55,15.85 T1.E
  Top 0.406: U4.5 49.87,12.99 50.29,12.57 51.42,12.57 R2.P$2
N$6
  Top 0.279: U4.1 47.88,9.65
  Top 0.406: IC1.1 42.74,12.76 43.18,12.32 43.18,10.79 | 43.18,10.79 43.18,8.38 43.43,8.13 45.59,8.13 47.12,9.65 47.88,9.65 U4.1 | IC1.3 43.11,10.86 43.18,10.79
N$18
  Top 0.279: U4.3 49.22,7.83 R3.P$1
N$33
  Top 0.406: R12.P$2 C9.P$2
VDD  (via drill 0.25, 0.33)  (2 unrouted)
  Top 0.279: 56.9,8.26 56.94,8.3 U3.7 56.94,11.89 56.39,12.45 55.66,12.45 55.64,12.46 | 55.64,12.46 U3.10 | 53.69,12.48 U3.13 | 53.69,12.48 53.72,12.45 55.63,12.45 55.64,12.46 | U3.14 53.04,12.49 53.09,12.45 53.66,12.45 53.69,12.48
  Top 0.33: R7.P$2 16.39,6.11 v16.38,6.1 | R1.P$1 v14.61,33.53
  Top 0.406: U4.7 48.57,13.01 48.13,12.57 46.49,12.57 C19.P$1 v46.48,13.21 | C18.P$1 v42.29,14.22 | IC1.2 v40.89,11.81 | R21.P$2 v41.78,9.4 | R3.P$2 v46.99,7.75 | 56.9,8.26 56.9,7.76 C21.P$1 58.04,7.49 58.8,8.26 C20.1
  Top 0.61: v20.45,10.67 20.97,10.67 C4.P$1
  Route2 0.61: v16.38,6.1 19.3,6.1 19.94,6.73 19.94,10.16 v20.45,10.67
  other vias: 21.21,14.86 21.84,14.86 22.48,14.86 23.11,14.86 23.75,14.86 24.38,14.86 25.02,14.86 21.21,14.22 21.84,14.22 22.48,14.22 23.11,14.22 23.75,14.22 24.38,14.22 25.02,14.22 49.53,18.41 49.53,17.78 58.42,10.92 59.18,10.92
  pour Top (no thermals): 19.62,9.78 20.32,9.78 20.7,10.16 25.65,10.16 25.65,15.24 20.83,15.24 20.83,11.81 19.62,10.6
  pour Route2: 13.59,34.16 13.59,29.46 17.02,29.46 17.02,12.19 18.03,11.18 18.03,0 66.04,0 66.04,2.54 68.58,5.08 68.58,21.72 44.96,21.72 44.96,17.14 39.62,17.14 39.62,11.05 35.69,11.05 35.69,21.72 25.78,21.72 25.78,34.16